# EAGLE design stamp-fixed-smt-mk-1.1 (EAGLE 7.5.0)
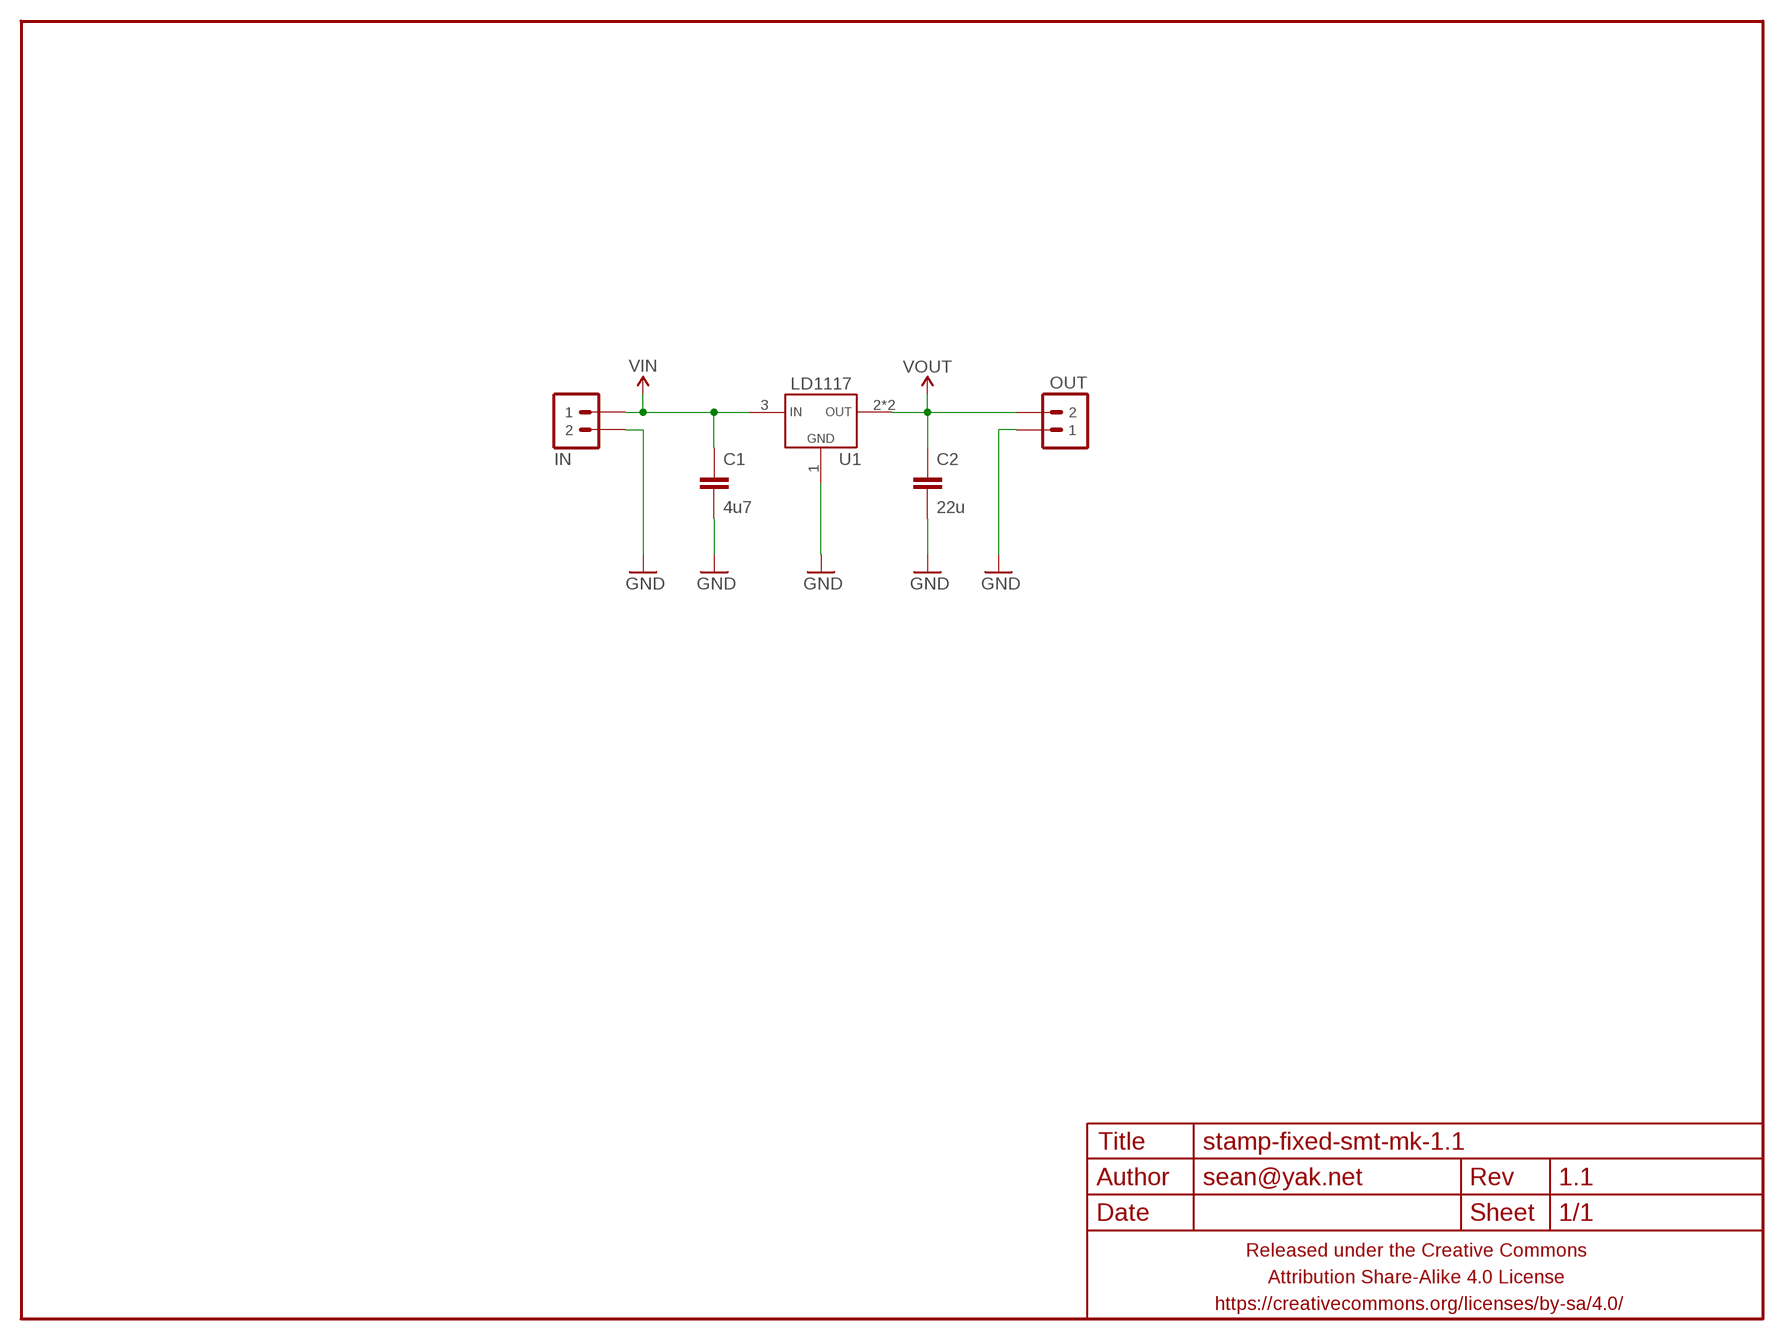
[diagram p0: schematic, sheet 1]

## Parts
C1  4u7  CAPACITOR-CERAMICC0805-TIGHTER  [C0805-TIGHTER]
C2  22u  CAPACITOR-CERAMICC0805-TIGHTER  [C0805-TIGHTER]
FRAME1  FRAME-LETTERNO_PACKAGE  [DUMMY]
IN  M02PTH-CENTERED-L+  [1X02-CENTER-L+]
OUT  M02PTH-CENTERED-R+  [1X02-CENTER-R+]
U1  LD1117  VREG_1117SOT223  [SOT223]

## Nets
GND: C1.2 C2.2 IN.2 OUT.1 U1.1(GND)
VIN: C1.1 IN.1 U1.3(VIN)
VOUT: C2.1 OUT.2 U1.2(VOUT) U1.4(VOUT)

## Library data of the parts
C1 C2 = a_parts:CAPACITOR-CERAMIC: CAPACITOR, European symbol
FRAME1 = a_parts:FRAME-LETTER: Schematic Frame Standard 8.5x11 US Letter frame; DESIGNER: sean@yak.net; VERSION: 1.1
IN OUT = a_parts:M02: Standard 2-pin 0.1" header. Use with - straight break away headers ( PRT-00116) - right angle break away headers (PRT-00553) - swiss pins (PRT-00743) - machine pins (PRT-00117) - female headers (PRT-00115) Molex polarized connector foot print use with: PRT-08233 with associated crimp pins and housings. 2.54_SCREWTERM for use with PRT-10571. 3.5mm Screw Terminal footprints for PRT-08084 5mm Screw Terminal footprints for use with PRT-08433
U1 = a_parts:VREG_1117

## Board
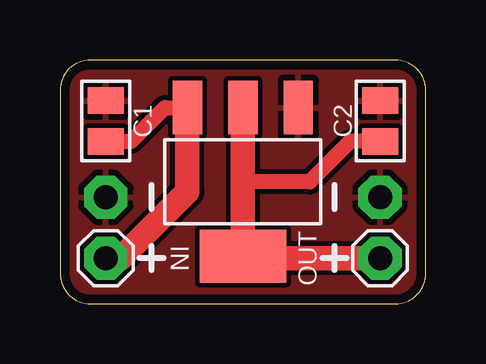
[diagram p1: board, top side]
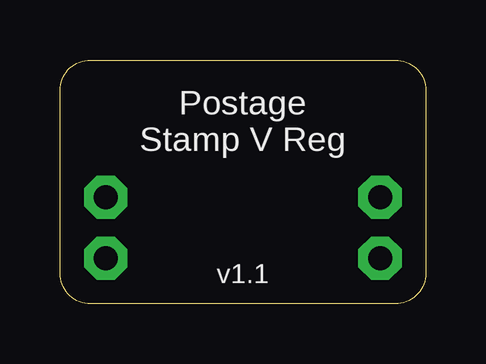
[diagram p2: board, bottom side, seen from below]

Size 15.24 x 10.16 mm. Coordinates in mm from the lower left corner, seen from the top.
Outline: 15.24,1.27 15.24,8.89 arc90 13.97,10.16 1.27,10.16 arc90 0,8.89 0,1.27 arc90 1.27,0 13.97,0 arc90 15.24,1.27
Copper layers (1*16): Top 0.0356mm / dielectric 1.5011mm / Bottom 0.0356mm
Design rules "LaenPCBOrder2": minimum track width 6mil, minimum drill 13mil, track to track 6mil, track to pad 6mil, pad to pad 6mil, via to via 6mil, smd to smd 6mil, copper to edge 15mil, drill to drill 6mil, minimum pad ring 7mil, minimum via ring 7mil, stop-mask expansion 3mil, vias tented up to drill 20mil, thermal gap 10mil

### Footprints (pad centres in the part's own frame; a part is rotated, then mirrored left to right if it is on the bottom)
C0805-TIGHTER = smd 1.1 x 1.5: 1 -0.85,0; 2 0.85,0
1X02-CENTER-L+ = drill 1 pad 1.8 octagon: 1 -1.27,0; 2 1.27,0
1X02-CENTER-R+ = drill 1 pad 1.8 octagon: 1 -1.27,0; 2 1.27,0
SOT223 = smd 1.219 x 2.235: 1 -2.311,-3.099; 2 0,-3.099; 3 2.311,-3.099 | smd 3.6 x 2.2: 4 0,3.099

### Placement (x,y rotation side)
C1  1.91,7.62 90 top
C2  13.34,7.62 90 top
FRAME1  0,0 0 top
IN  1.91,3.17 90 top
OUT  13.34,3.17 270 top
U1  7.62,5.08 180 top

### Tracks (layer width: path | path; a pad name or v marks a point on that pad's centre or on a via)
GND
  pour Top (isolate 0.2): 0,8.89 0,1.27 arc90 1.27,0 13.97,0 arc90 15.24,1.27 15.24,8.89 arc90 13.97,10.16 1.27,10.16 arc90
VIN
  Top 0.635: C1.1 2.96,6.77 4.37,8.18 U1.3
  Top 1.016: IN.1 2.54,1.91 5.31,4.67 U1.3
VOUT
  Top 0.635: C2.1 12.1,6.77 10.41,5.08 7.62,5.08
  Top 1.016: U1.2 7.62,5.08 U1.4 7.7,1.91 OUT.2

### Text on the board
bPlace: Postage / Stamp V Reg